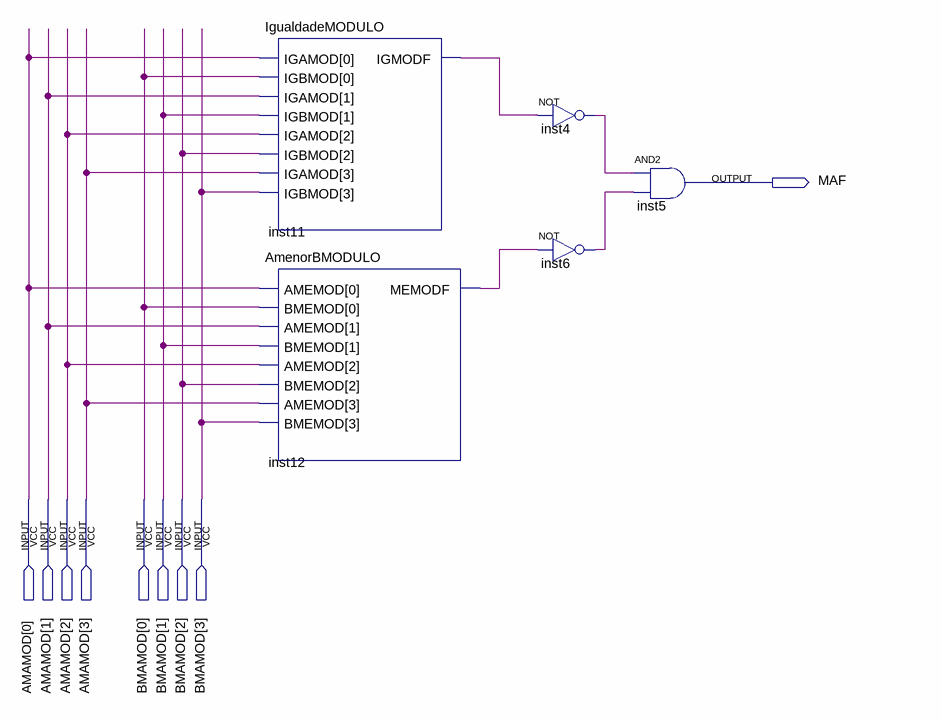
[diagram p0: schematic sheet]
// Quartus schematic AmaiorBMODULO.bdf as structural Verilog: 5 symbols, 9 pins
module AmaiorBMODULO (
  input  [3:0] AMAMOD,
  input  [3:0] BMAMOD,
  output MAF
);

  wire inst4_out, inst6_out, inst11_igmodf, inst12_memodf;

  IgualdadeMODULO inst11 (.IGAMOD(AMAMOD), .IGBMOD(BMAMOD), .IGMODF(inst11_igmodf));
  AmenorBMODULO inst12 (.AMEMOD(AMAMOD), .BMEMOD(BMAMOD), .MEMODF(inst12_memodf));
  not inst4 (inst4_out, inst11_igmodf);
  not inst6 (inst6_out, inst12_memodf);
  and inst5 (MAF, inst4_out, inst6_out);
endmodule
